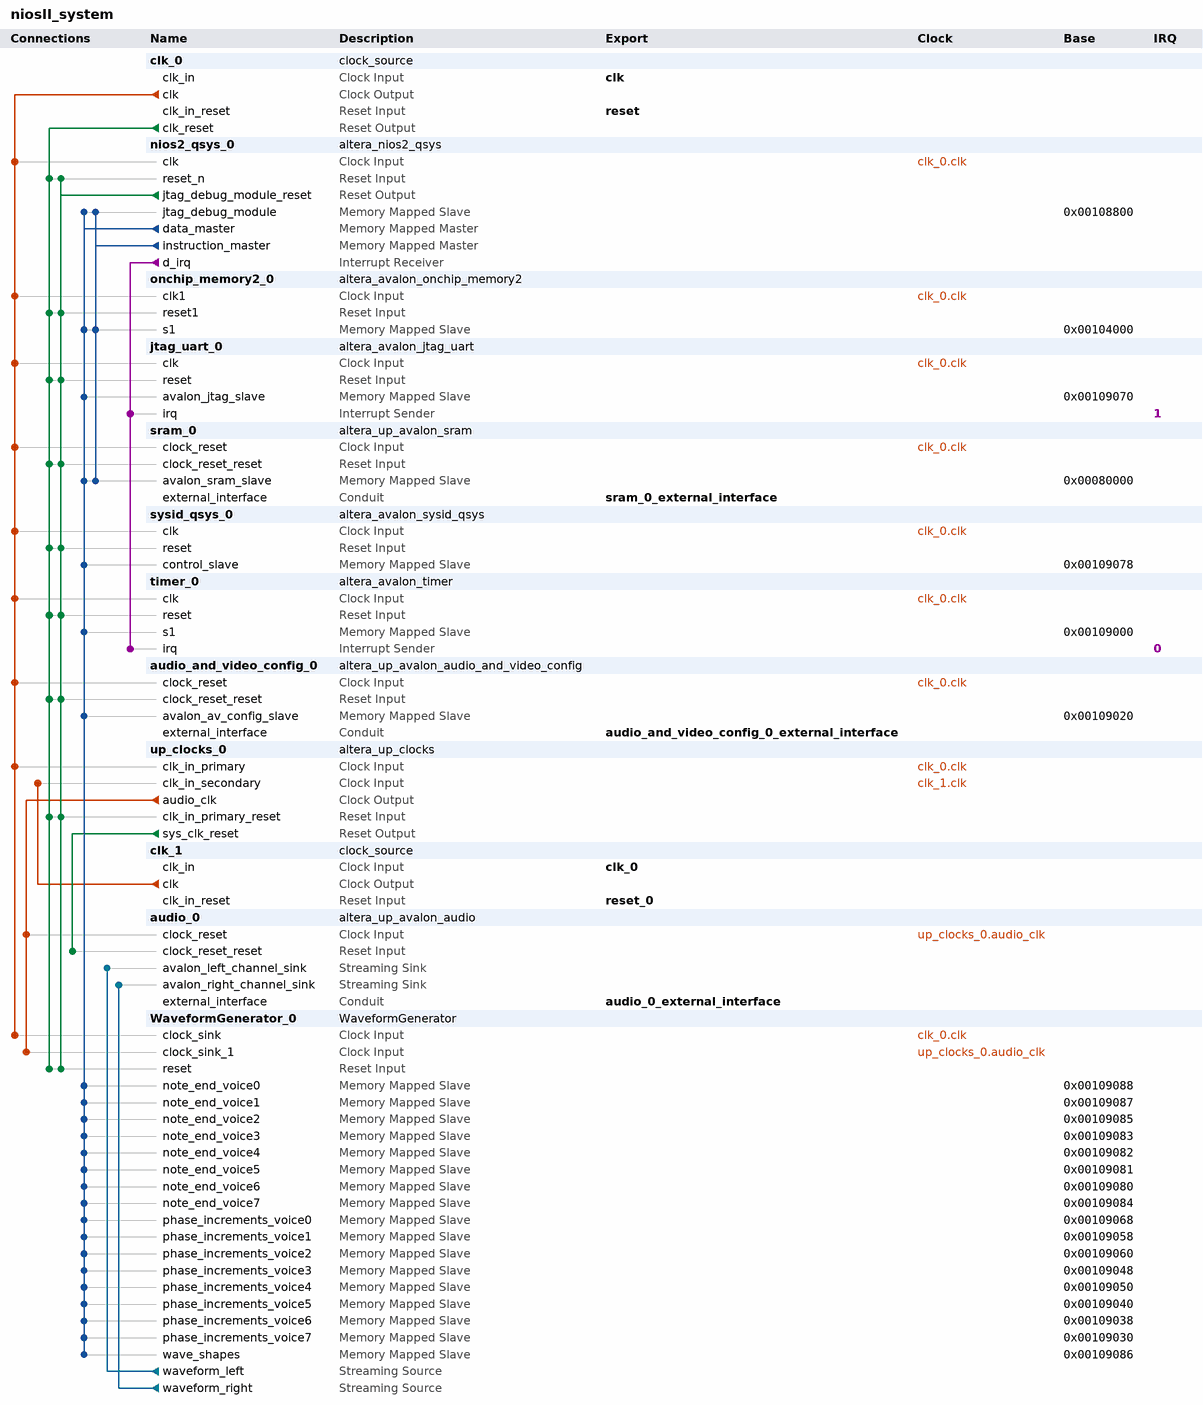
[diagram p0: system contents]
# Platform Designer (Qsys) system niosII_system, Cyclone II EP2C35F672C6
# Parameters at their usual value, and those the tool derives, are not listed.
package require -exact qsys 12.1
create_system niosII_system
set_project_property DEVICE_FAMILY {Cyclone II}
set_project_property DEVICE EP2C35F672C6

add_instance clk_0 clock_source 12.1
set_instance_parameter_value clk_0 clockFrequency 50000000

add_instance nios2_qsys_0 altera_nios2_qsys 12.1
set_instance_parameter_value nios2_qsys_0 resetSlave onchip_memory2_0.s1
set_instance_parameter_value nios2_qsys_0 exceptionSlave onchip_memory2_0.s1
set_instance_parameter_value nios2_qsys_0 breakSlave nios2_qsys_0.jtag_debug_module
set_instance_parameter_value nios2_qsys_0 impl Tiny
set_instance_parameter_value nios2_qsys_0 icache_size 4096

add_instance onchip_memory2_0 altera_avalon_onchip_memory2 12.1
set_instance_parameter_value onchip_memory2_0 dataWidth 32
set_instance_parameter_value onchip_memory2_0 dualPort false
set_instance_parameter_value onchip_memory2_0 initMemContent true
set_instance_parameter_value onchip_memory2_0 initializationFileName onchip_memory2_0
set_instance_parameter_value onchip_memory2_0 memorySize 16384

add_instance jtag_uart_0 altera_avalon_jtag_uart 12.1
set_instance_parameter_value jtag_uart_0 simInteractiveOptions INTERACTIVE_INPUT_OUTPUT

add_instance sram_0 altera_up_avalon_sram 12.0
set_instance_parameter_value sram_0 board DE2
set_instance_parameter_value sram_0 pixel_buffer false

add_instance sysid_qsys_0 altera_avalon_sysid_qsys 12.1
set_instance_parameter_value sysid_qsys_0 id 0

add_instance timer_0 altera_avalon_timer 12.1
set_instance_parameter_value timer_0 period 1
set_instance_parameter_value timer_0 periodUnits MSEC
set_instance_parameter_value timer_0 timerPreset CUSTOM

add_instance audio_and_video_config_0 altera_up_avalon_audio_and_video_config 12.0
set_instance_parameter_value audio_and_video_config_0 board DE2
set_instance_parameter_value audio_and_video_config_0 audio_in {Line In to ADC}
set_instance_parameter_value audio_and_video_config_0 line_in_bypass false
set_instance_parameter_value audio_and_video_config_0 bit_length 16
set_instance_parameter_value audio_and_video_config_0 sampling_rate {32 kHz}

add_instance up_clocks_0 altera_up_clocks 12.0
set_instance_parameter_value up_clocks_0 board DE2
set_instance_parameter_value up_clocks_0 sdram_clk false
set_instance_parameter_value up_clocks_0 vga_clk false
set_instance_parameter_value up_clocks_0 audio_clk true
set_instance_parameter_value up_clocks_0 audio_clk_freq 12.288

add_instance clk_1 clock_source 12.1
set_instance_parameter_value clk_1 clockFrequency 27000000

add_instance audio_0 altera_up_avalon_audio 12.0
set_instance_parameter_value audio_0 avalon_bus_type Streaming
set_instance_parameter_value audio_0 audio_in true
set_instance_parameter_value audio_0 dw 16

add_instance WaveformGenerator_0 WaveformGenerator 1.0

# connections
add_connection clk_0.clk audio_and_video_config_0.clock_reset clock
add_connection clk_0.clk jtag_uart_0.clk clock
add_connection clk_0.clk nios2_qsys_0.clk clock
add_connection clk_0.clk onchip_memory2_0.clk1 clock
add_connection clk_0.clk sram_0.clock_reset clock
add_connection clk_0.clk sysid_qsys_0.clk clock
add_connection clk_0.clk timer_0.clk clock
add_connection clk_0.clk up_clocks_0.clk_in_primary clock
add_connection clk_0.clk WaveformGenerator_0.clock_sink clock
add_connection clk_1.clk up_clocks_0.clk_in_secondary clock
add_connection up_clocks_0.audio_clk audio_0.clock_reset clock
add_connection up_clocks_0.audio_clk WaveformGenerator_0.clock_sink_1 clock
add_connection clk_0.clk_reset audio_and_video_config_0.clock_reset_reset reset
add_connection clk_0.clk_reset jtag_uart_0.reset reset
add_connection clk_0.clk_reset nios2_qsys_0.reset_n reset
add_connection clk_0.clk_reset onchip_memory2_0.reset1 reset
add_connection clk_0.clk_reset sram_0.clock_reset_reset reset
add_connection clk_0.clk_reset sysid_qsys_0.reset reset
add_connection clk_0.clk_reset timer_0.reset reset
add_connection clk_0.clk_reset up_clocks_0.clk_in_primary_reset reset
add_connection clk_0.clk_reset WaveformGenerator_0.reset reset
add_connection nios2_qsys_0.jtag_debug_module_reset audio_and_video_config_0.clock_reset_reset reset
add_connection nios2_qsys_0.jtag_debug_module_reset jtag_uart_0.reset reset
add_connection nios2_qsys_0.jtag_debug_module_reset nios2_qsys_0.reset_n reset
add_connection nios2_qsys_0.jtag_debug_module_reset onchip_memory2_0.reset1 reset
add_connection nios2_qsys_0.jtag_debug_module_reset sram_0.clock_reset_reset reset
add_connection nios2_qsys_0.jtag_debug_module_reset sysid_qsys_0.reset reset
add_connection nios2_qsys_0.jtag_debug_module_reset timer_0.reset reset
add_connection nios2_qsys_0.jtag_debug_module_reset up_clocks_0.clk_in_primary_reset reset
add_connection nios2_qsys_0.jtag_debug_module_reset WaveformGenerator_0.reset reset
add_connection up_clocks_0.sys_clk_reset audio_0.clock_reset_reset reset
add_connection nios2_qsys_0.data_master audio_and_video_config_0.avalon_av_config_slave avalon
set_connection_parameter_value nios2_qsys_0.data_master/audio_and_video_config_0.avalon_av_config_slave baseAddress 0x00109020
add_connection nios2_qsys_0.data_master jtag_uart_0.avalon_jtag_slave avalon
set_connection_parameter_value nios2_qsys_0.data_master/jtag_uart_0.avalon_jtag_slave baseAddress 0x00109070
add_connection nios2_qsys_0.data_master nios2_qsys_0.jtag_debug_module avalon
set_connection_parameter_value nios2_qsys_0.data_master/nios2_qsys_0.jtag_debug_module baseAddress 0x00108800
add_connection nios2_qsys_0.data_master onchip_memory2_0.s1 avalon
set_connection_parameter_value nios2_qsys_0.data_master/onchip_memory2_0.s1 baseAddress 0x00104000
add_connection nios2_qsys_0.data_master sram_0.avalon_sram_slave avalon
set_connection_parameter_value nios2_qsys_0.data_master/sram_0.avalon_sram_slave baseAddress 0x00080000
add_connection nios2_qsys_0.data_master sysid_qsys_0.control_slave avalon
set_connection_parameter_value nios2_qsys_0.data_master/sysid_qsys_0.control_slave baseAddress 0x00109078
add_connection nios2_qsys_0.data_master timer_0.s1 avalon
set_connection_parameter_value nios2_qsys_0.data_master/timer_0.s1 baseAddress 0x00109000
add_connection nios2_qsys_0.data_master WaveformGenerator_0.note_end_voice0 avalon
set_connection_parameter_value nios2_qsys_0.data_master/WaveformGenerator_0.note_end_voice0 baseAddress 0x00109088
add_connection nios2_qsys_0.data_master WaveformGenerator_0.note_end_voice1 avalon
set_connection_parameter_value nios2_qsys_0.data_master/WaveformGenerator_0.note_end_voice1 baseAddress 0x00109087
add_connection nios2_qsys_0.data_master WaveformGenerator_0.note_end_voice2 avalon
set_connection_parameter_value nios2_qsys_0.data_master/WaveformGenerator_0.note_end_voice2 baseAddress 0x00109085
add_connection nios2_qsys_0.data_master WaveformGenerator_0.note_end_voice3 avalon
set_connection_parameter_value nios2_qsys_0.data_master/WaveformGenerator_0.note_end_voice3 baseAddress 0x00109083
add_connection nios2_qsys_0.data_master WaveformGenerator_0.note_end_voice4 avalon
set_connection_parameter_value nios2_qsys_0.data_master/WaveformGenerator_0.note_end_voice4 baseAddress 0x00109082
add_connection nios2_qsys_0.data_master WaveformGenerator_0.note_end_voice5 avalon
set_connection_parameter_value nios2_qsys_0.data_master/WaveformGenerator_0.note_end_voice5 baseAddress 0x00109081
add_connection nios2_qsys_0.data_master WaveformGenerator_0.note_end_voice6 avalon
set_connection_parameter_value nios2_qsys_0.data_master/WaveformGenerator_0.note_end_voice6 baseAddress 0x00109080
add_connection nios2_qsys_0.data_master WaveformGenerator_0.note_end_voice7 avalon
set_connection_parameter_value nios2_qsys_0.data_master/WaveformGenerator_0.note_end_voice7 baseAddress 0x00109084
add_connection nios2_qsys_0.data_master WaveformGenerator_0.phase_increments_voice0 avalon
set_connection_parameter_value nios2_qsys_0.data_master/WaveformGenerator_0.phase_increments_voice0 baseAddress 0x00109068
add_connection nios2_qsys_0.data_master WaveformGenerator_0.phase_increments_voice1 avalon
set_connection_parameter_value nios2_qsys_0.data_master/WaveformGenerator_0.phase_increments_voice1 baseAddress 0x00109058
add_connection nios2_qsys_0.data_master WaveformGenerator_0.phase_increments_voice2 avalon
set_connection_parameter_value nios2_qsys_0.data_master/WaveformGenerator_0.phase_increments_voice2 baseAddress 0x00109060
add_connection nios2_qsys_0.data_master WaveformGenerator_0.phase_increments_voice3 avalon
set_connection_parameter_value nios2_qsys_0.data_master/WaveformGenerator_0.phase_increments_voice3 baseAddress 0x00109048
add_connection nios2_qsys_0.data_master WaveformGenerator_0.phase_increments_voice4 avalon
set_connection_parameter_value nios2_qsys_0.data_master/WaveformGenerator_0.phase_increments_voice4 baseAddress 0x00109050
add_connection nios2_qsys_0.data_master WaveformGenerator_0.phase_increments_voice5 avalon
set_connection_parameter_value nios2_qsys_0.data_master/WaveformGenerator_0.phase_increments_voice5 baseAddress 0x00109040
add_connection nios2_qsys_0.data_master WaveformGenerator_0.phase_increments_voice6 avalon
set_connection_parameter_value nios2_qsys_0.data_master/WaveformGenerator_0.phase_increments_voice6 baseAddress 0x00109038
add_connection nios2_qsys_0.data_master WaveformGenerator_0.phase_increments_voice7 avalon
set_connection_parameter_value nios2_qsys_0.data_master/WaveformGenerator_0.phase_increments_voice7 baseAddress 0x00109030
add_connection nios2_qsys_0.data_master WaveformGenerator_0.wave_shapes avalon
set_connection_parameter_value nios2_qsys_0.data_master/WaveformGenerator_0.wave_shapes baseAddress 0x00109086
add_connection nios2_qsys_0.instruction_master nios2_qsys_0.jtag_debug_module avalon
set_connection_parameter_value nios2_qsys_0.instruction_master/nios2_qsys_0.jtag_debug_module baseAddress 0x00108800
add_connection nios2_qsys_0.instruction_master onchip_memory2_0.s1 avalon
set_connection_parameter_value nios2_qsys_0.instruction_master/onchip_memory2_0.s1 baseAddress 0x00104000
add_connection nios2_qsys_0.instruction_master sram_0.avalon_sram_slave avalon
set_connection_parameter_value nios2_qsys_0.instruction_master/sram_0.avalon_sram_slave baseAddress 0x00080000
add_connection WaveformGenerator_0.waveform_left audio_0.avalon_left_channel_sink avalon_streaming
add_connection WaveformGenerator_0.waveform_right audio_0.avalon_right_channel_sink avalon_streaming
add_connection nios2_qsys_0.d_irq jtag_uart_0.irq interrupt
set_connection_parameter_value nios2_qsys_0.d_irq/jtag_uart_0.irq irqNumber 1
add_connection nios2_qsys_0.d_irq timer_0.irq interrupt
set_connection_parameter_value nios2_qsys_0.d_irq/timer_0.irq irqNumber 0

# exported interfaces
add_interface clk clock sink
set_interface_property clk EXPORT_OF clk_0.clk_in
add_interface reset reset sink
set_interface_property reset EXPORT_OF clk_0.clk_in_reset
add_interface sram_0_external_interface conduit end
set_interface_property sram_0_external_interface EXPORT_OF sram_0.external_interface
add_interface clk_0 clock sink
set_interface_property clk_0 EXPORT_OF clk_1.clk_in
add_interface reset_0 reset sink
set_interface_property reset_0 EXPORT_OF clk_1.clk_in_reset
add_interface audio_and_video_config_0_external_interface conduit end
set_interface_property audio_and_video_config_0_external_interface EXPORT_OF audio_and_video_config_0.external_interface
add_interface audio_0_external_interface conduit end
set_interface_property audio_0_external_interface EXPORT_OF audio_0.external_interface

save_system niosII_system.qsys
